# Altium schematic sheet Reefing-Telemetry.SchDoc: Reefing System
size A4; DocumentNumber: Subtitle; Revision: V1.0; SheetNumber: 6; SheetTotal: 13; Author: Luca Jost; Subtitle: Telemetry
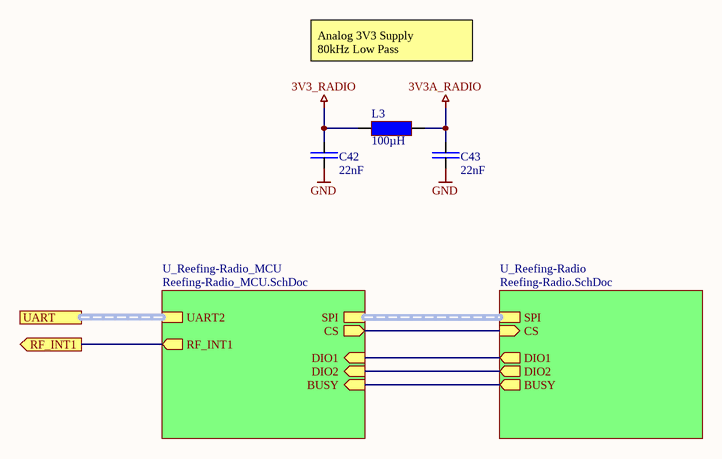
[diagram p0: Reefing-Telemetry.SchDoc]

## Parts
C42  22nF  [SMD Keramikkondensator 0805]
C43  22nF  [SMD Keramikkondensator 0805]
L3  100µH  [SMD Inductor 1812]

## Sub-sheets
U_Reefing-Radio = Reefing-Radio.SchDoc: SPI (harness SPI), CS (in), BUSY (out), DIO1 (out), DIO2 (out)
U_Reefing-Radio_MCU = Reefing-Radio_MCU.SchDoc: SPI (harness SPI), RF_INT1 (out), UART2 (harness UART), BUSY (in), DIO2 (in), DIO1 (in), CS (out)

## Ports
RF_INT1 (out), UART

## Nets
3V3_RADIO: C42.2 L3.1
3V3A_RADIO: C43.2 L3.2
GND: C42.1 C43.1
RF_INT1: port RF_INT1, sheet U_Reefing-Radio_MCU/RF_INT1
(unnamed): sheet U_Reefing-Radio/CS, sheet U_Reefing-Radio_MCU/CS
(unnamed): sheet U_Reefing-Radio/BUSY, sheet U_Reefing-Radio_MCU/BUSY
(unnamed): sheet U_Reefing-Radio/DIO1, sheet U_Reefing-Radio_MCU/DIO1
(unnamed): sheet U_Reefing-Radio/DIO2, sheet U_Reefing-Radio_MCU/DIO2

## Buses and harness runs
harness port UART = sheet U_Reefing-Radio_MCU/UART2
harness sheet U_Reefing-Radio/SPI = sheet U_Reefing-Radio_MCU/SPI

## Notes on the sheet
- Analog 3V3 Supply
  80kHz Low Pass
- Title
- Author:
- Subtitle
- Date:
- Rev:
- File:
- Sheet
- of

## Library data of the parts
C42 C43 = E6 - 22nF: SMD Ceramic Capacitor E6; Unit Price: 0.01; Number: -; Supplier: -
L3 = Inductor 100µH / 0.25A: 0.25A 100µH ±20% 144mΩ SMD Power Inductors; ComponentLink1Description: Datasheet; ComponentLink1URL: https://datasheet.lcsc.com/lcsc/2110081330_Sunlord-SPH252012H3R3MT_C98379.pdf; JLC: C76822